# Altium schematic sheet P2_SoC.SchDoc
size C
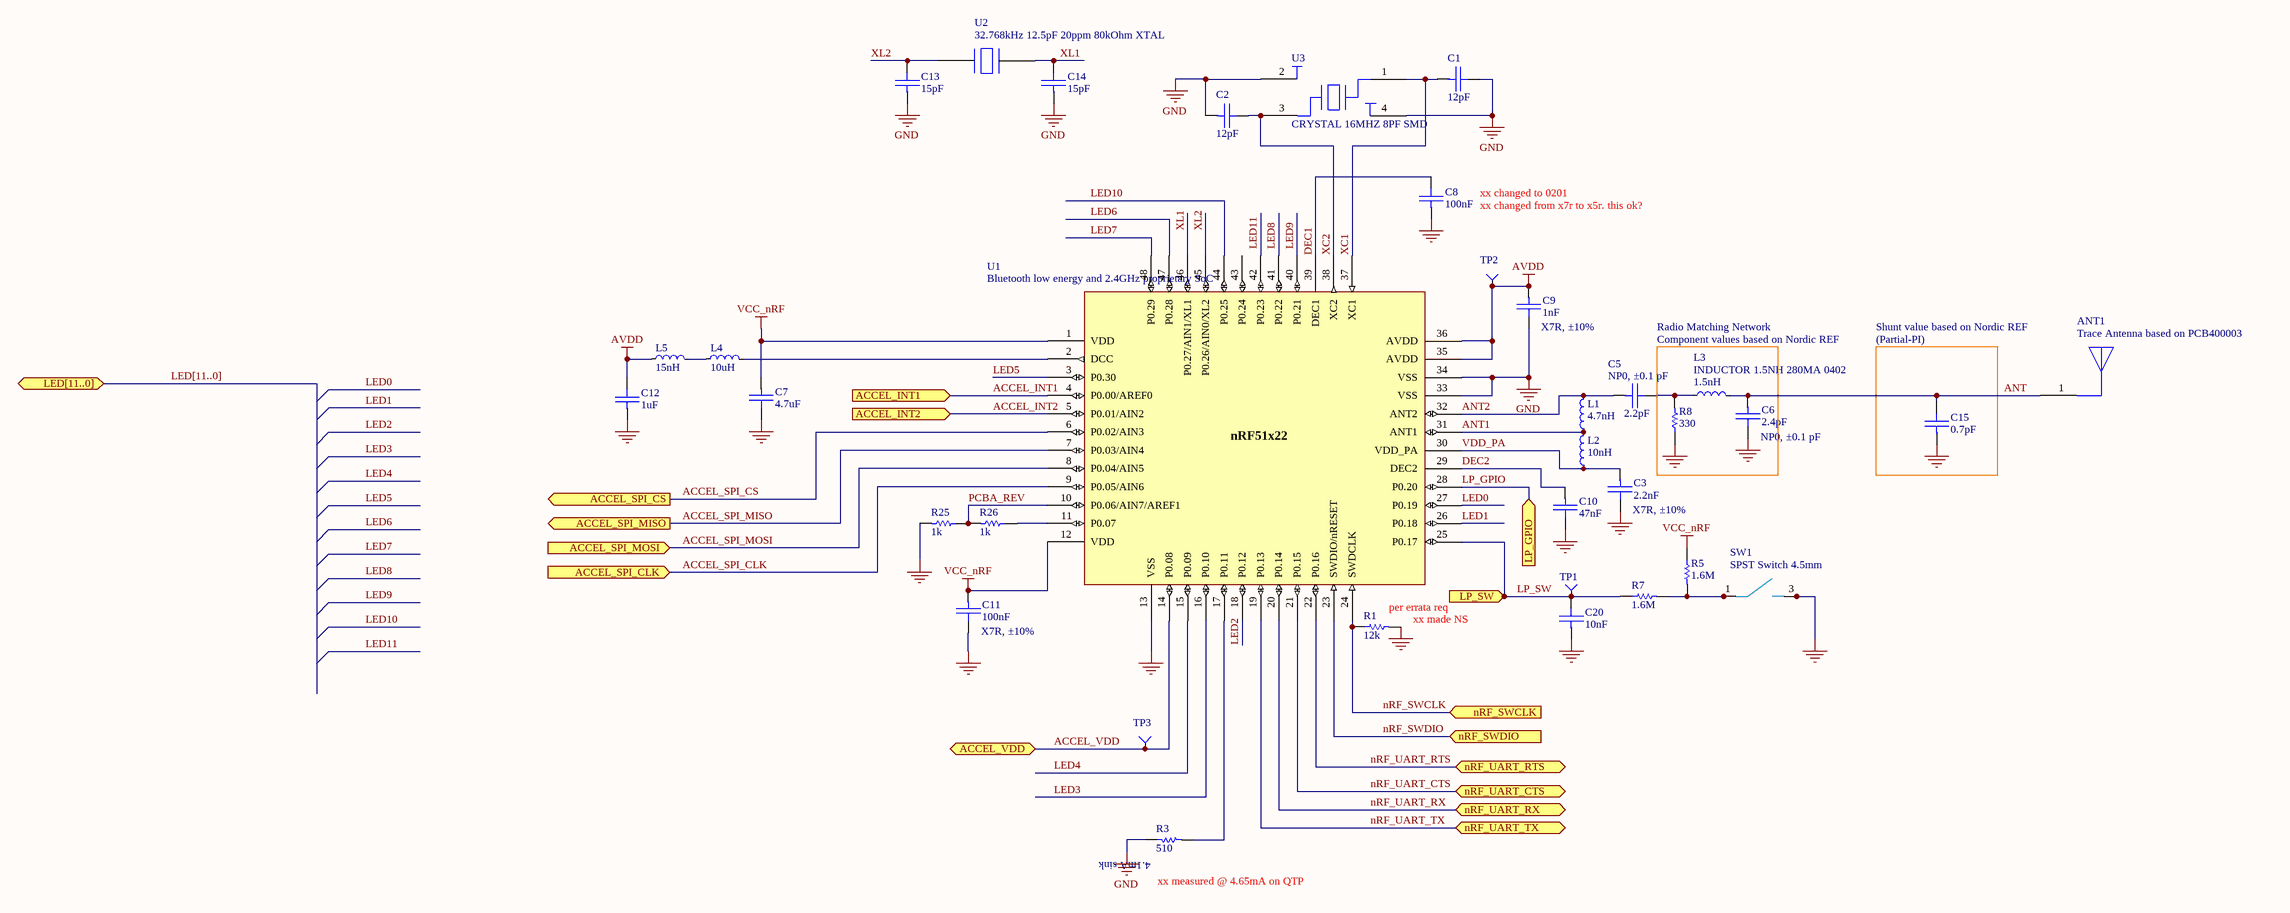
[diagram p0: P2_SoC.SchDoc]

## Parts
ANT1  Trace Antenna based on PCB400003  [NORDIC_MEAND]
C1  value 12pF  [CAPC0201(0603)_N]  (hidden comment: CAP CER 12PF 25V 5% NP0 0201)
C2  value 12pF  [CAPC0201(0603)_N]  (hidden comment: CAP CER 12PF 25V 5% NP0 0201)
C3  value 2.2nF  [CAPC0402(1005)_N]  (hidden comment: CAP CER 2200PF 50V 10% X7R 0402)
C5  value 2.2pF  [CAPC0402(1005)_N]  (hidden comment: CAP CER 2.2PF 50V NP0 0402)
C6  value 2.4pF  [CAPC0402(1005)_N]  (hidden comment: CAP CER 2.4PF 50V NP0 0402)
C7  value 4.7uF  [CAPC0603(1608)_N]  (hidden comment: CAP CER 4.7UF 6.3V 10% X5R 0603)
C8  value 100nF  [CAPC0201(0603)_N]  (hidden comment: CAP CER 0.1UF 10V 10% X5R 0201)
C9  value 1nF  [CAPC0402(1005)_N]  (hidden comment: CAP CER 1000PF 50V 10% X7R 0402)
C10  value 47nF  [CAPC0402(1005)_N]  (hidden comment: CAP CER 0.047UF 16V 10% X7R 0402)
C11  value 100nF  [CAPC0402(1005)_N]  (hidden comment: CAP CER 0.1UF 16V 10% X7R 0402)
C12  value 1uF  [CAPC0603(1608)_N]  (hidden comment: CAP CER 1UF 16V 20% X7R 0603)
C13  value 15pF  [CAPC0201(0603)_N]  (hidden comment: CAP CER 15PF 25V 5% NP0 0201)
C14  value 15pF  [CAPC0201(0603)_N]  (hidden comment: CAP CER 15PF 25V 5% NP0 0201)
C15  value 0.7pF  [CAPC0402(1005)_N]  (hidden comment: CAP CER 0.7PF 50V NP0 0402)
C20  value 10nF  [CAPC0201(0603)_N]  (hidden comment: CAP CER 10000PF 10V 10% X7R 0201)
L1  value 4.7nH  [INDC0402(1005)_N]  (hidden comment: INDUCTOR 4.7NH 160MA 0402)
L2  value 10nH  [INDC0402(1005)_N]  (hidden comment: INDUCTOR 10NH 100MA 0402)
L3  INDUCTOR 1.5NH 280MA 0402  value 1.5nH  [INDC0402(1005)_N]
L4  value 10uH  [INDC0603(1608)_N]  (hidden comment: INDUCTOR 10UH 80MA 10% 0603)
L5  value 15nH  [INDC0402(1005)_N]  (hidden comment: INDUCTOR HI FREQ 15NH 5% 0402)
R1  value 12k  [RESC0201(0603)_N]  (hidden comment: RES 12K OHM 1/20W 1% 0201 SMD)
R3  value 510  [RESC0201(0603)_N]  (hidden comment: RES 510 OHM 1/20W 5% 0201 SMD)
R5  value 1.6M  [RESC0402(1005)_N]  (hidden comment: RES 1.60M OHM 1/16W 1% 0402 SMD)
R7  value 1.6M  [RESC0402(1005)_N]  (hidden comment: RES 1.60M OHM 1/16W 1% 0402 SMD)
R8  value 330  [RESC0402(1005)_N]  (hidden comment: RES 330 OHM 1/16W 5% 0402 SMD)
R25  value 1k  [RESC0201(0603)_N]  (hidden comment: RES 1K OHM 1/20W 5% 0201 SMD)
R26  value 1k  [RESC0201(0603)_N]  (hidden comment: RES 1K OHM 1/20W 5% 0201 SMD)
SW1  SPST Switch 4.5mm  [PTS530]
TP1  12MIL SMT Test Point  [SMT_TP_12MIL]  (value not drawn)
TP2  .767mm SMT Test Point  [SMT_TP_p767mm]  (value not drawn)
TP3  .767mm SMT Test Point  [SMT_TP_p767mm]  (value not drawn)
U1  Bluetooth low energy and 2.4GHz proprietary SoC  [QFN40P600X600X90-48N]
U2  32.768kHz 12.5pF 20ppm 80kOhm XTAL  [ECX-12]
U3  CRYSTAL 16MHZ 8PF SMD  [NX2520SA]

## Ports
ACCEL_INT1, ACCEL_INT2, ACCEL_SPI_CLK, ACCEL_SPI_CS, ACCEL_SPI_MISO, ACCEL_SPI_MOSI, ACCEL_VDD, LED[11..0], LP_GPIO, LP_SW, nRF_SWCLK, nRF_SWDIO, nRF_UART_CTS, nRF_UART_RTS, nRF_UART_RX, nRF_UART_TX

## Nets
AVDD: C9.1 C12.2 L5.1 TP2.1(TP) U1.35(AVDD) U1.36(AVDD)
GND: C1.2 C2.1 C3.2 C6.2 C7.2 C8.1 C9.2 C10.2 C11.2 C12.1 C13.1 C14.1 C15.1 C20.1 R1.2 R3.1 R8.1 R25.2 SW1.3 SW1.4 U1.13(VSS) U1.33(VSS) U1.34(VSS) U1.49 U3.2(gnd) U3.4(GND)
VCC_nRF: C7.1 C11.1 R5.1 U1.1(VDD) U1.12(VDD)
ACCEL_INT1: U1.4(P0.00/AREF0) ; port ACCEL_INT1
ACCEL_INT2: U1.5(P0.01/AIN2) ; port ACCEL_INT2
ACCEL_SPI_CLK: U1.9(P0.05/AIN6) ; port ACCEL_SPI_CLK
ACCEL_SPI_CS: U1.6(P0.02/AIN3) ; port ACCEL_SPI_CS
ACCEL_SPI_MISO: U1.7(P0.03/AIN4) ; port ACCEL_SPI_MISO
ACCEL_SPI_MOSI: U1.8(P0.04/AIN5) ; port ACCEL_SPI_MOSI
ACCEL_VDD: TP3.1(TP) U1.14(P0.08) ; port ACCEL_VDD
ANT: ANT1.1(Feed_Point) C6.1 C15.2 L3.2
ANT1: L1.1 L2.2 U1.31(ANT1)
ANT2: C5.1 L1.2 U1.32(ANT2)
DEC1: C8.2 U1.39(DEC1)
DEC2: C10.1 U1.29(DEC2)
LED0: U1.27(P0.19)
LED1: U1.26(P0.18)
LED2: U1.18(P0.12)
LED3: U1.16(P0.10)
LED4: U1.15(P0.09)
LED5: U1.3(P0.30)
LED6: U1.47(P0.28)
LED7: U1.48(P0.29)
LED8: U1.41(P0.22)
LED9: U1.40(P0.21)
LED10: U1.44(P0.25)
LED11: U1.42(P0.23)
LP_GPIO: U1.28(P0.20) ; port LP_GPIO
LP_SW: C20.2 R7.1 TP1.1(TP) U1.25(P0.17) ; port LP_SW
nRF_SWCLK: R1.1 U1.24(SWDCLK) ; port nRF_SWCLK
nRF_SWDIO: U1.23(SWDIO/nRESET) ; port nRF_SWDIO
nRF_UART_CTS: U1.21(P0.15) ; port nRF_UART_CTS
nRF_UART_RTS: U1.22(P0.16) ; port nRF_UART_RTS
nRF_UART_RX: U1.20(P0.14) ; port nRF_UART_RX
nRF_UART_TX: U1.19(P0.13) ; port nRF_UART_TX
PCBA_REV: R25.1 R26.2 U1.10(P0.06/AIN7/AREF1)
VDD_PA: C3.1 L2.1 U1.30(VDD_PA)
XC1: C1.1 U1.37(XC1) U3.1(I/O)
XC2: C2.2 U1.38(XC2) U3.3(I/O)
XL1: C14.2 U1.46(P0.27/AIN1/XL1) U2.2
XL2: C13.2 U1.45(P0.26/AIN0/XL2) U2.1
NetC5_2: C5.2 L3.1 R8.2
NetL4_1: L4.1 L5.2
NetL4_2: L4.2 U1.2(DCC)
NetR3_2: R3.2 U1.17(P0.11)
NetR5_2: R5.2 R7.2 SW1.1 SW1.2
NetR26_1: R26.1 U1.11(P0.07)

Not connected (* = marked no-connect by the designer): U1 43(P0.24)

## Buses and harness runs
bus LED[11..0] = port LED[11..0]

## Notes on the sheet
- xx changed to 0201
- xx changed from x7r to x5r. this ok?
- (near C9) X7R, ±10%
- Radio Matching Network
- Shunt value based on Nordic REF
- (near C5) NP0, ±0.1 pF
- Component values based on Nordic REF
- (Partial-PI)
- (near C6) NP0, ±0.1 pF
- (near C3) X7R, ±10%
- per errata req
- xx made NS
- (near C11) Analog Stuff Option Tracking
  R26         |     R25
  0MOhm     |     1MOhm    ==> 06-00019-000 REV9
  1k             |      1k            ==> REV10
- (near C11) X7R, ±10%
- (near R3) 4.1mA sink
- (near R3) xx measured @ 4.65mA on QTP
- Title
- Size:
- Date:
- File:
- C
- Number:
- Time:
- Revision:
- Sheet
- of
- (in symbol 03-07191-000) nRF51x22

## Library data of the parts
ANT1 = 03-07140-000: Nordic-Based Trace Antenna per PCB400003; Legacy Item Number: X01015; RoHS: Y; Item Number: 03-07140-000; Item Name: Trace Antenna based on PCB400003; Lifecycle: Preliminary; Link to Arena Files: https://app.bom.com/a/8Q9IOJ2J2LL8MEWP?v=files.associations
C1 C2 = 03-02453-000: Manufacturer 1: Samsung Electro-Mechanics America Inc; Manufacturer Item 1: CU0131120JAT2A\5K; Manufacturer Part Number 1: CL03C120JA3ANNC; Temperature Coefficient: C0G NP0; Case EIA: 201; Case Metric: 603; Tolerance: +/-5%; Legacy Item Number: C02200; RoHS: Y; Voltage Rating: 25V; Manufacturer 2: TDK Corporation; Item Number: 03-02453-000; Item Name: CAP CER 12PF 25V 5% NP0 0201; Lifecycle: Design; Manufacturer Item 2: 02013A120JAT2A; Link to Arena Files: https://app.bom.com/a/CUDMSN6N6PPCQMU0?v=files.associations; Manufacturer 3: Kemet; Manufacturer 4: Murata Electronics North America; Manufacturer Part Number 2: C0603C0G1E120J030BA; Manufacturer Part Number 3: C0201C120J3GACTU; Manufacturer Part Number 4: GRM0335C1E120JA01D; Revision: 1; Supplier 1: Avnet; Supplier 2: Avnet; Supplier 3: Digi-key; Supplier 4: Digi-key; Supplier Part Number 1: CL03C120JA3ANNC; Supplier Part Number 2: C0603C0G1E120J030BA; Supplier Part Number 3: 399-8927-1-ND; Supplier Part Number 4: 490-3144-1-ND
C3 = 03-01841-000: Manufacturer 1: NIC Components; Manufacturer Item 1: 04025C222KAT2A; Manufacturer Part Number 1: NMC0402X7R222K50TRPF; Case EIA: 402; Case Metric: 1005; Tolerance: +/-10%; Legacy Item Number: C03370; Temperature Coefficient: X7R; RoHS: Y; Voltage Rating: 50V; Manufacturer 2: Samsung Electro-Mechanics America Inc; Item Number: 03-01841-000; Item Name: CAP CER 2200PF 50V 10% X7R 0402; Lifecycle: Design; Manufacturer Item 2: C0402C222K5RACTU; Link to Arena Files: https://app.bom.com/a/SAT283M3M55S63SC?v=files.associations; Manufacturer 3: Kemet; Manufacturer 4: Murata Electronics North America; Manufacturer Part Number 2: CL05B222KB5NNNC; Manufacturer Part Number 3: C0402C222K5RACTU; Manufacturer Part Number 4: GRM155R71H222KA01D; Revision: 1; Supplier 1: Avnet; Supplier 2: Avnet; Supplier 3: Digi-key; Supplier 4: Digi-key; Supplier Part Number 1: NMC0402X7R222K50TRPF; Supplier Part Number 2: CL05B222KB5NNNC; Supplier Part Number 3: 399-3068-1-ND; Supplier Part Number 4: 490-1305-1-ND
C5 = 03-01536-000: Manufacturer 1: Murata Electronics North America; Manufacturer Item 1: 04025A2R2BAT2A; Manufacturer Part Number 1: GRM1555C1H2R2BA01D; Temperature Coefficient: C0G NP0; Case EIA: 402; Case Metric: 1005; Tolerance: +/-0.1pF; Legacy Item Number: C03065; RoHS: Y; Voltage Rating: 50V; Item Number: 03-01536-000; Item Name: CAP CER 2.2PF 50V NP0 0402; Lifecycle: Design; Link to Arena Files: https://app.bom.com/a/1J2BHCVCVEE1FCAX?v=files.associations; Manufacturer 2: Samsung Electro-Mechanics America Inc; Manufacturer Item 2: GRM1555C1H2R2BA01D; Manufacturer 3: AVX Corporation; Manufacturer Part Number 2: CL05C2R2BB5ANNC; Manufacturer Part Number 3: 04025A2R2BAT2A; Revision: 1; Supplier 1: Avnet; Supplier 2: Avnet; Supplier 3: Digi-key; Supplier Part Number 1: GRM1555C1H2R2BA01D; Supplier Part Number 2: CL05C2R2BB5ANNC; Supplier Part Number 3: 478-7876-1-ND
C6 = 03-01539-000: Manufacturer 1: Murata Electronics North America; Manufacturer Part Number 1: GRM1555C1H2R4BA01D; Temperature Coefficient: C0G NP0; Case EIA: 402; Case Metric: 1005; Tolerance: +/-0.1pF; Legacy Item Number: C03068; RoHS: Y; Voltage Rating: 50V; Item Number: 03-01539-000; Lifecycle: Preliminary; Link to Arena Files: https://app.bom.com/a/4M5EKFYFYHH4IFDM?v=files.associations; Supplier 1: Digi-key; Supplier Part Number 1: 490-6228-1-ND
C7 = 03-01442-000: Manufacturer 1: Samsung Electro-Mechanics America Inc; Manufacturer Item 1: 06036D475KAT2A; Manufacturer Part Number 1: CL10A475KQ8NNNC; Case EIA: 603; Case Metric: 1608; Tolerance: +/-10%; Legacy Item Number: C04789; Temperature Coefficient: X5R; RoHS: Y; Voltage Rating: 6.3V; Manufacturer 2: Samsung Electro-Mechanics America Inc; Item Number: 03-01442-000; Item Name: CAP CER 4.7UF 6.3V 10% X5R 0603; Lifecycle: Design; Manufacturer Item 2: C0603C475K9PACTU; Link to Arena Files: https://app.bom.com/a/DVENTO7O7QQDROOX?v=files.associations; Manufacturer 3: AVX Corporation; Manufacturer 4: Kemet; Manufacturer Part Number 2: CL10A475KQ5NNNC; Manufacturer Part Number 3: 06036D475KAT2A; Manufacturer Part Number 4: C0603C475K9PACTU; Revision: 1; Supplier 1: Avnet; Supplier 2: Avnet; Supplier 3: Digi-key; Supplier 4: Digi-key; Supplier Part Number 1: CL10A475KQ8NNNC; Supplier Part Number 2: CL10A475KQ5NNNC; Supplier Part Number 3: 478-5009-1-ND; Supplier Part Number 4: 399-3482-1-ND
C8 = 03-02751-000: Manufacturer 1: Murata Electronics North America; Manufacturer Item 1: GRM033R61A104KE15D; Case EIA: 201; Case Metric: 603; Tolerance: +/-10%; Legacy Item Number: C02498; Temperature Coefficient: X5R; RoHS: Y; Voltage Rating: 10V; Item Number: 03-02751-000; Item Name: CAP CER 0.1UF 10V 10% X5R 0201; Lifecycle: Design; Link to Arena Files: https://app.bom.com/a/UCV4A5O5O77U844W?v=files.associations; Manufacturer 2: TDK Corporation; Manufacturer Item 2: LMK063BJ104KP-F; Manufacturer Part Number 1: GRM033R61A104KE15D; Manufacturer Part Number 2: C0603X5R1A104K030BC; Revision: 1; Supplier 1: Avnet; Supplier 2: Avnet; Supplier Part Number 1: GRM033R61A104KE15D; Supplier Part Number 2: C0603X5R1A104K030BC
C9 = 03-01810-000: Manufacturer 1: NIC Components; Manufacturer Item 1: 04025C102KAT2A; Manufacturer Part Number 1: NMC0402X7R102K50TRPF; Case EIA: 402; Case Metric: 1005; Tolerance: +/-10%; Legacy Item Number: C03339; Temperature Coefficient: X7R; RoHS: Y; Voltage Rating: 50V; Item Number: 03-01810-000; Item Name: CAP CER 1000PF 50V 10% X7R 0402; Lifecycle: Design; Link to Arena Files: https://app.bom.com/a/WEX6C7Q7Q99WA7XM?v=files.associations; Manufacturer 2: Samsung Electro-Mechanics America Inc; Manufacturer Item 2: C0402T102K5RACTU; Manufacturer 3: AVX Corporation; Manufacturer 4: Kemet; Manufacturer Part Number 2: CL05B102KB5NNNC; Manufacturer Part Number 3: 04025C102KAT2A; Manufacturer Part Number 4: C0402C102K5RACTU; Revision: 1; Supplier 1: Avnet; Supplier 2: Avnet; Supplier 3: Digi-key; Supplier 4: Digi-key; Supplier Part Number 1: NMC0402X7R102K50TRPF; Supplier Part Number 2: CL05B102KB5NNNC; Supplier Part Number 3: 478-1101-1-ND; Supplier Part Number 4: 399-1032-1-ND
C10 = 03-02012-000: Manufacturer 1: Kemet; Manufacturer Item 1: 0402YC473KAT2A; Manufacturer Part Number 1: C0402C473K4RAC TU; Case EIA: 402; Case Metric: 1005; Tolerance: +/-10%; Legacy Item Number: C03541; Temperature Coefficient: X7R; RoHS: Y; Voltage Rating: 16V; Manufacturer 2: Samsung Electro-Mechanics America Inc; Item Number: 03-02012-000; Item Name: CAP CER 0.047UF 16V 10% X7R 0402; Lifecycle: Design; Manufacturer Item 2: C0402C473K4RACTU; Link to Arena Files: https://app.bom.com/a/P7QZ50J0J22P30KA?v=files.associations; Manufacturer 3: Murata Electronics North America; Manufacturer 4: Murata Electronics North America; Manufacturer Part Number 2: CL05B473KO5NNNC; Manufacturer Part Number 3: GRM155R71C473KA01D; Manufacturer Part Number 4: GCM155R71C473KA37D; Revision: 1; Supplier 1: Avnet; Supplier 2: Avnet; Supplier 3: Digi-key; Supplier 4: Digi-key; Supplier Part Number 1: C0402C473K4RAC TU; Supplier Part Number 2: CL05B473KO5NNNC; Supplier Part Number 3: 490-6335-1-ND; Supplier Part Number 4: 490-6042-1-ND
C11 = 03-02077-000: Manufacturer 1: Kemet; Manufacturer Item 1: C0402C104K4RACTU; Manufacturer Part Number 1: C0402C104K4RAC TU; Case EIA: 402; Case Metric: 1005; Tolerance: +/-10%; Legacy Item Number: C03606; Temperature Coefficient: X7R; RoHS: Y; Voltage Rating: 16V; Manufacturer 2: Samsung Electro-Mechanics America Inc; Item Number: 03-02077-000; Item Name: CAP CER 0.1UF 16V 10% X7R 0402; Lifecycle: Design; Manufacturer Item 2: C0402C104K4RACAUTO; Link to Arena Files: https://app.bom.com/a/L3MV1WFWFYYLZVEO?v=files.associations; Manufacturer 3: Kemet; Manufacturer 4: Kemet; Manufacturer Part Number 2: CL05B104KO5NNNC; Manufacturer Part Number 3: C0402C104K4RACTU; Manufacturer Part Number 4: C0402C104K4RACAUTO; Revision: 1; Supplier 1: Avnet; Supplier 2: Avnet; Supplier 3: Digi-key; Supplier 4: Digi-key; Supplier Part Number 1: C0402C104K4RAC TU; Supplier Part Number 2: CL05B104KO5NNNC; Supplier Part Number 3: 399-3521-1-ND; Supplier Part Number 4: 399-6828-1-ND
C12 = 03-01346-000: Manufacturer 1: Samsung Electro-Mechanics America Inc; Manufacturer Item 1: GRM188R71C105MA12D; Manufacturer Part Number 1: CL10B105KO8NNND; Case EIA: 603; Case Metric: 1608; Tolerance: +/-20%; Legacy Item Number: C04693; Temperature Coefficient: X7R; RoHS: Y; Voltage Rating: 16V; Manufacturer 2: TAIYO YUDEN; Item Number: 03-01346-000; Item Name: CAP CER 1UF 16V 20% X7R 0603; Lifecycle: Design; Manufacturer Item 2: C1608X7R1C105M080AC; Link to Arena Files: https://app.bom.com/a/M4NW2XGXGZZM0X0Z?v=files.associations; Manufacturer 3: Murata Electronics North America; Manufacturer 4: TDK Corporation; Manufacturer Part Number 2: EMK107B7105KAHT; Manufacturer Part Number 3: GRM188R71C105MA12D; Manufacturer Part Number 4: CGA3E1X7R1C105M080AC; Revision: 1; Supplier 1: Avnet; Supplier 2: Avnet; Supplier 3: Digi-key; Supplier 4: Digi-key; Supplier Part Number 1: CL10B105KO8NNND; Supplier Part Number 2: EMK107B7105KAHT; Supplier Part Number 3: 490-6424-1-ND; Supplier Part Number 4: 445-12540-1-ND
C13 C14 = 03-02464-000: Manufacturer 1: Samsung Electro-Mechanics America Inc; Manufacturer Part Number 1: CL03C150JA3ANNC; Legacy Item Number: C02211; Case EIA: 201; Case Metric: 603; Temperature Coefficient: C0G NP0; Tolerance: +/-5%; Item Number: 03-02464-000; RoHS: Y; Lifecycle: Design; Link to Arena Files: https://app.bom.com/a/N5OX3YHYH00N1X5P?v=files.associations; Revision: 1; Supplier 1: Digi-key; Supplier Part Number 1: 1276-1390-1-ND; Manufacturer 2: TDK Corporation; Manufacturer Part Number 2: C0603C0G1E150J030BA; Supplier 2: Digi-key; Supplier Part Number 2: 445-4655-1-ND; Voltage Rating: 25V
C15 = 03-01494-000: Manufacturer 1: Murata Electronics North America; Manufacturer Part Number 1: GJM1555C1HR70BB01D; Legacy Item Number: C03023; Case EIA: 402; Case Metric: 1005; Temperature Coefficient: C0G NP0; Tolerance: +/-0.1pF; Item Number: 03-01494-000; RoHS: Y; Lifecycle: Preliminary; Link to Arena Files: https://app.bom.com/a/UCV4A5O5O77U854V?v=files.associations; Supplier 1: Digi-key; Supplier Part Number 1: 490-6079-1-ND; Manufacturer 2: Murata Electronics North America; Manufacturer Part Number 2: GRM1535C1HR70BDD5D; Supplier 2: Digi-key; Supplier Part Number 2: 490-6165-1-ND; Manufacturer 3: Murata Electronics North America; Manufacturer Part Number 3: GRM1555C1HR70BA01D; Supplier 3: Digi-key; Supplier Part Number 3: 490-6267-1-ND; Voltage Rating: 50V
C20 = 03-02706-000: Manufacturer 1: Murata Electronics North America; Manufacturer Item 1: GRM033R71A103KA01J; Manufacturer Part Number 1: GRM033R71A103KA01D; Case EIA: 201; Case Metric: 603; Tolerance: +/-10%; Legacy Item Number: C02453; Temperature Coefficient: X7R; RoHS: Y; Voltage Rating: 10V; Item Number: 03-02706-000; Item Name: CAP CER 10000PF 10V 10% X7R 0201; Lifecycle: Design; Link to Arena Files: https://app.bom.com/a/K2LU0VEVEXXKYUVT?v=files.associations; Manufacturer 2: Samsung Electro-Mechanics America Inc; Manufacturer Item 2: GRM033R71A103KA01D; Manufacturer 3: Murata Electronics North America; Manufacturer 4: Murata Electronics North America; Manufacturer Part Number 2: CL03B103KP3NNNC; Manufacturer Part Number 3: GCM033R71A103KA03D; Manufacturer Part Number 4: GRM033R71A103KA01J; Revision: 1; Supplier 1: Avnet; Supplier 2: Avnet; Supplier 3: Digi-key; Supplier 4: Digi-key; Supplier Part Number 1: GRM033R71A103KA01D; Supplier Part Number 2: CL03B103KP3NNNC; Supplier Part Number 3: 490-6040-1-ND; Supplier Part Number 4: 490-6143-1-ND
L1 = 03-07166-000: Manufacturer 1: Murata; Manufacturer Item 1: LQP15MN4N7B02D; Legacy Item Number: L01007; Package / Case: 0402(1005); RoHS: Y; Item Number: 03-07166-000; Item Name: INDUCTOR 4.7NH 160MA 0402; Lifecycle: Design; Link to Arena Files: https://app.bom.com/a/9RAJPK3K3MM9NDKS?v=files.associations; Manufacturer Part Number 1: LQP15MN4N7B02D; Revision: 1; Supplier 1: Avnet; Supplier Part Number 1: LQP15MN4N7B02D
L2 = 03-07167-000: Manufacturer 1: Murata; Manufacturer Item 1: 81-LQP15MN10NG02D; Legacy Item Number: L01008; Package / Case: 0402(1005); RoHS: Y; Item Number: 03-07167-000; Item Name: INDUCTOR 10NH 100MA 0402; Lifecycle: Design; Link to Arena Files: https://app.bom.com/a/ASBKQL4L4NNAOELD?v=files.associations; Manufacturer Part Number 1: 81-LQP15MN10NG02D; Revision: 1; Supplier 1: Avnet; Supplier Part Number 1: LQP15MN10NG02D
L3 = 03-07203-000: Manufacturer 1: Murata Electronics North America; Manufacturer Part Number 1: LQP15MN1N5B02D; Package / Case: 0402(1005); RoHS: Y; Item Number: 03-07203-000; Lifecycle: Design; Link to Arena Files: https://app.bom.com/a/8Q9IOJ2J2LL7MRTG?v=files.associations; Revision: 1; Supplier 1: Digi-key; Supplier Part Number 1: 490-1126-1-ND
L4 = 03-07169-000: Manufacturer 1: TAIYO YUDEN; Manufacturer Item 1: LBMF1608T100K; Legacy Item Number: L01010; Package / Case: 0603 (1608); RoHS: Y; Item Number: 03-07169-000; Item Name: INDUCTOR 10UH 80MA 10% 0603; Lifecycle: Design; Link to Arena Files: https://app.bom.com/a/CUDMSN6N6PPCQGND?v=files.associations; Manufacturer Part Number 1: LBMF1608T100K; Revision: 1; Supplier 1: Avnet; Supplier Part Number 1: LBMF1608T100K
L5 = 03-07170-000: Manufacturer 1: Samsung Electro-Mechanics America Inc; Manufacturer Item 1: HK100515NJ-T; Manufacturer Part Number 1: CIH05T15NJNC; Legacy Item Number: L01011; Package / Case: 0402(1005); RoHS: Y; Item Number: 03-07170-000; Item Name: INDUCTOR HI FREQ 15NH 5% 0402; Lifecycle: Design; Link to Arena Files: https://app.bom.com/a/DVENTO7O7QQDRHOC?v=files.associations; Manufacturer 2: TAIYO YUDEN; Manufacturer Part Number 2: HK100515NJ-T; Revision: 1; Supplier 1: Avnet; Supplier 2: Avnet; Supplier Part Number 1: CIH05T15NJNC; Supplier Part Number 2: HK100515NJ-T
R1 = 03-03710-000: Manufacturer 1: Panasonic Electronic Components; Manufacturer Item 1: ERJ-1GEF1202C; Temperature Coefficient: 0.05W 1/20W; Case EIA: 201; Case Metric: 603; Tolerance: +/-1%; Legacy Item Number: R02520; RoHS: Y; Manufacturer 2: Vishay Dale; Item Number: 03-03710-000; Item Name: RES 12K OHM 1/20W 1% 0201 SMD; Lifecycle: Preliminary; Manufacturer Item 2: CRCW020112K0FKED; Link to Arena Files: https://app.bom.com/a/TBU394N4N66T728F?v=files.associations; Manufacturer 3: Yageo; Manufacturer Part Number 1: ERJ-1GEF1202C; Manufacturer Part Number 2: CRCW020112K0FKED; Manufacturer Part Number 3: RC0201FR-0712KL; Power Rating: 0.05W 1/20W; Supplier 1: Digi-key; Supplier 2: Digi-key; Supplier 3: Digi-key; Supplier Part Number 1: P12.0KABCT-ND; Supplier Part Number 2: 541-12.0KAABCT-ND; Supplier Part Number 3: 311-12.0KMCT-ND
R3 = 03-03256-000: Manufacturer 1: Panasonic Electronic Components; Manufacturer Item 1: ERJ-1GEJ511C; Temperature Coefficient: 0.05W 1/20W; Case EIA: 201; Case Metric: 603; Tolerance: +/-5%; Legacy Item Number: R02066; RoHS: Y; Item Number: 03-03256-000; Item Name: RES 510 OHM 1/20W 5% 0201 SMD; Lifecycle: Design; Link to Arena Files: https://app.bom.com/a/Q8R061K1K33Q4ZH2?v=files.associations; Manufacturer Part Number 1: ERJ-1GEJ511C; Power Rating: 0.05W 1/20W; Revision: 1; Supplier 1: Digi-key; Supplier Part Number 1: P510AGCT-ND
R5 R7 = 03-04846-000: Manufacturer 1: Vishay Dale; Manufacturer Item 1: CRCW04021M60FKED; Temperature Coefficient: 0.063W 1/16W; Case EIA: 402; Case Metric: 1005; Tolerance: +/-1%; Legacy Item Number: R03915; RoHS: Y; Item Number: 03-04846-000; Item Name: RES 1.60M OHM 1/16W 1% 0402 SMD; Lifecycle: Design; Link to Arena Files: https://app.bom.com/a/CUDMSN6N6PPCQKUF?v=files.associations; Manufacturer Part Number 1: CRCW04021M60FKED; Power Rating: 0.063W 1/16W; Revision: 1; Supplier 1: Digi-key; Supplier Part Number 1: 541-1.60MLCT-ND
R8 = 03-04000-000: Manufacturer 1: Panasonic Electronic Components; Manufacturer Part Number 1: ERJ-2GEJ331X; Legacy Item Number: R03069; Case EIA: 402; Case Metric: 1005; Power Rating: 0.063W 1/16W; Tolerance: +/-5%; Item Number: 03-04000-000; RoHS: Y; Lifecycle: Preliminary; Link to Arena Files: https://app.bom.com/a/3L4DJEXEXGG3HCA8?v=files.associations; Supplier 1: Digi-key; Supplier Part Number 1: P330JCT-ND; Manufacturer 2: Vishay Dale; Manufacturer Part Number 2: CRCW0402330RJNED; Supplier 2: Digi-key; Supplier Part Number 2: 541-330JCT-ND; Manufacturer 3: Yageo; Manufacturer Part Number 3: RC0402JR-07330RL; Supplier 3: Digi-key; Supplier Part Number 3: 311-330JRCT-ND
R25 R26 = 03-03263-000: Manufacturer 1: Panasonic Electronic Components; Manufacturer Part Number 1: ERJ-1GEJ102C; Case EIA: 201; Case Metric: 603; Tolerance: +/-5%; Legacy Item Number: R02073; Power Rating: 0.05W 1/20W; RoHS: Y; Manufacturer 2: Vishay Dale; Item Number: 03-03263-000; Lifecycle: Preliminary; Link to Arena Files: https://app.bom.com/a/YGZ8E9S9SBBYC7PH?v=files.associations; Manufacturer 3: Yageo; Manufacturer Part Number 2: CRCW02011K00JNED; Manufacturer Part Number 3: RC0201JR-071KL; Supplier 1: Digi-key; Supplier 2: Digi-key; Supplier 3: Digi-key; Supplier Part Number 1: P1.0KAGCT-ND; Supplier Part Number 2: 541-1.0KAGCT-ND; Supplier Part Number 3: 311-1KNCT-ND
SW1 = 03-07195-000: Manufacturer 1: C&K Components; Manufacturer Part Number 1: PTS530 GK055 SMTR LFS; Legacy Item Number: S01001; Item Number: 03-07195-000; Item Name: SPST Switch 4.5mm; Lifecycle: Design; Revision: 1; Link to Arena Files: https://app.bom.com/a/ASBKQL4L4NNABANC?v=files.associations; RoHS: Y
TP1 = 03-07143-000: Test Point; Legacy Item Number: X01018; RoHS: Y; Item Number: 03-07143-000; Item Name: 12MIL SMT Test Point; Lifecycle: Preliminary; Link to Arena Files: https://app.bom.com/a/BTCLRM5M5OOBPHZ8?v=files.associations
TP2 TP3 = 03-07130-000: Test Point; Legacy Item Number: X01005; RoHS: Y; Item Number: 03-07130-000; Item Name: .767mm SMT Test Point; Lifecycle: Preliminary; Link to Arena Files: https://app.bom.com/a/YGZ8E9S9SBBYC4MB?v=files.associations
U1 = 03-07191-000: Part Number: nRF51x22-Q48-6x6_DCDC; Manufacturer: Nordic Semiconductor; Manufacturer 1: Nordic; Manufacturer Item 1: nRF51822; Manufacturer Part Number 1: NRF51822-QFAA; Note: nRF51x22 - QFN48 6x6 0.4mm pitch; Artikkelnr Noca: N.A.; Legacy Item Number: U01013; Manufacturer Part Number: *; Datasheet: *; Footprint: QFN-48; LatestRevisionDate: 2012-05-29; Pin Count: 48; Publisher: Nordic Semiconductor; Published: 2010-12-21; Supplier: Nordic Semiconductor; Supplier part number: *; 2nd source Supplier: *; 2nd source part number: *; Package / Case: nRF51822-QFx; RoHS: Y; Item Number: 03-07191-000; Item Name: Bluetooth low energy and 2.4GHz proprietary SoC; Lifecycle: Design; Link to Arena Files: https://app.bom.com/a/6O7GMH0H0JJ6J8PA?v=files.associations; Revision: 1; Supplier 1: Digi-key; Supplier Part Number 1: 1490-1031-2-ND
U2 = 03-07202-000: Generic 2-port oscillator; Package / Case: ECX-12; RoHS: Y; Item Number: 03-07202-000; Lifecycle: Preliminary; Link to Arena Files: https://app.bom.com/a/N5OX3YHYH00M38KM?v=files.associations
U3 = 03-07138-000: Generic 4-port oscillator; Manufacturer 1: NDK; Manufacturer Item 1: NX2520SA-16MHZ-STD-CSW-4; Legacy Item Number: X01013; Vendor 1: Digi-key; Vendor Item 1: 644-1168-1-ND; RoHS: Y; Item Number: 03-07138-000; Item Name: CRYSTAL 16MHZ 8PF SMD; Lifecycle: Design; Link to Arena Files: https://app.bom.com/a/6O7GMH0H0JJ6KCUE?v=files.associations; Revision: 2; Manufacturer 2: Epson; Manufacturer Part Number 1: NX2520SA-16MHZ-STD-CSW-4; Manufacturer Part Number 2: FA-20H 16.0000MF 20X-AJ; Supplier 1: Digi-key; Supplier 2: Epson; Supplier Part Number 1: 644-1168-1-ND; Supplier Part Number 2: FA-20H 16.0000MF 20X-AJ